# Altium schematic sheet 0.1uF Cap.schdoc
size 124 x 101 mm
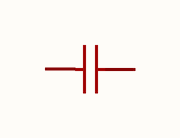
[diagram p0: 0.1uF Cap.schdoc]

## Parts
C?  1uF  [C0402]  (value not drawn)

## Nets

Not connected (* = marked no-connect by the designer): C? 1 2

## Library data of the parts
C? = CL05A105KO5NNNC: Manufacturer: SAMSUNG(三星); Add into BOM: yes; Tolerance: ±10%; Symbol: CL05A105KO5NNNC; Device: CL05A105KO5NNNC; LCSC Part Name: 1uF ±10% 16V; Supplier Part: C29266; Manufacturer Part: CL05A105KO5NNNC; Supplier Footprint: 0402; JLCPCB Part Class: Extended Part; Datasheet: https://atta.szlcsc.com/upload/public/pdf/source/20160218/1457707763339.pdf; Supplier: LCSC; Convert to PCB: yes; Value: 1uF